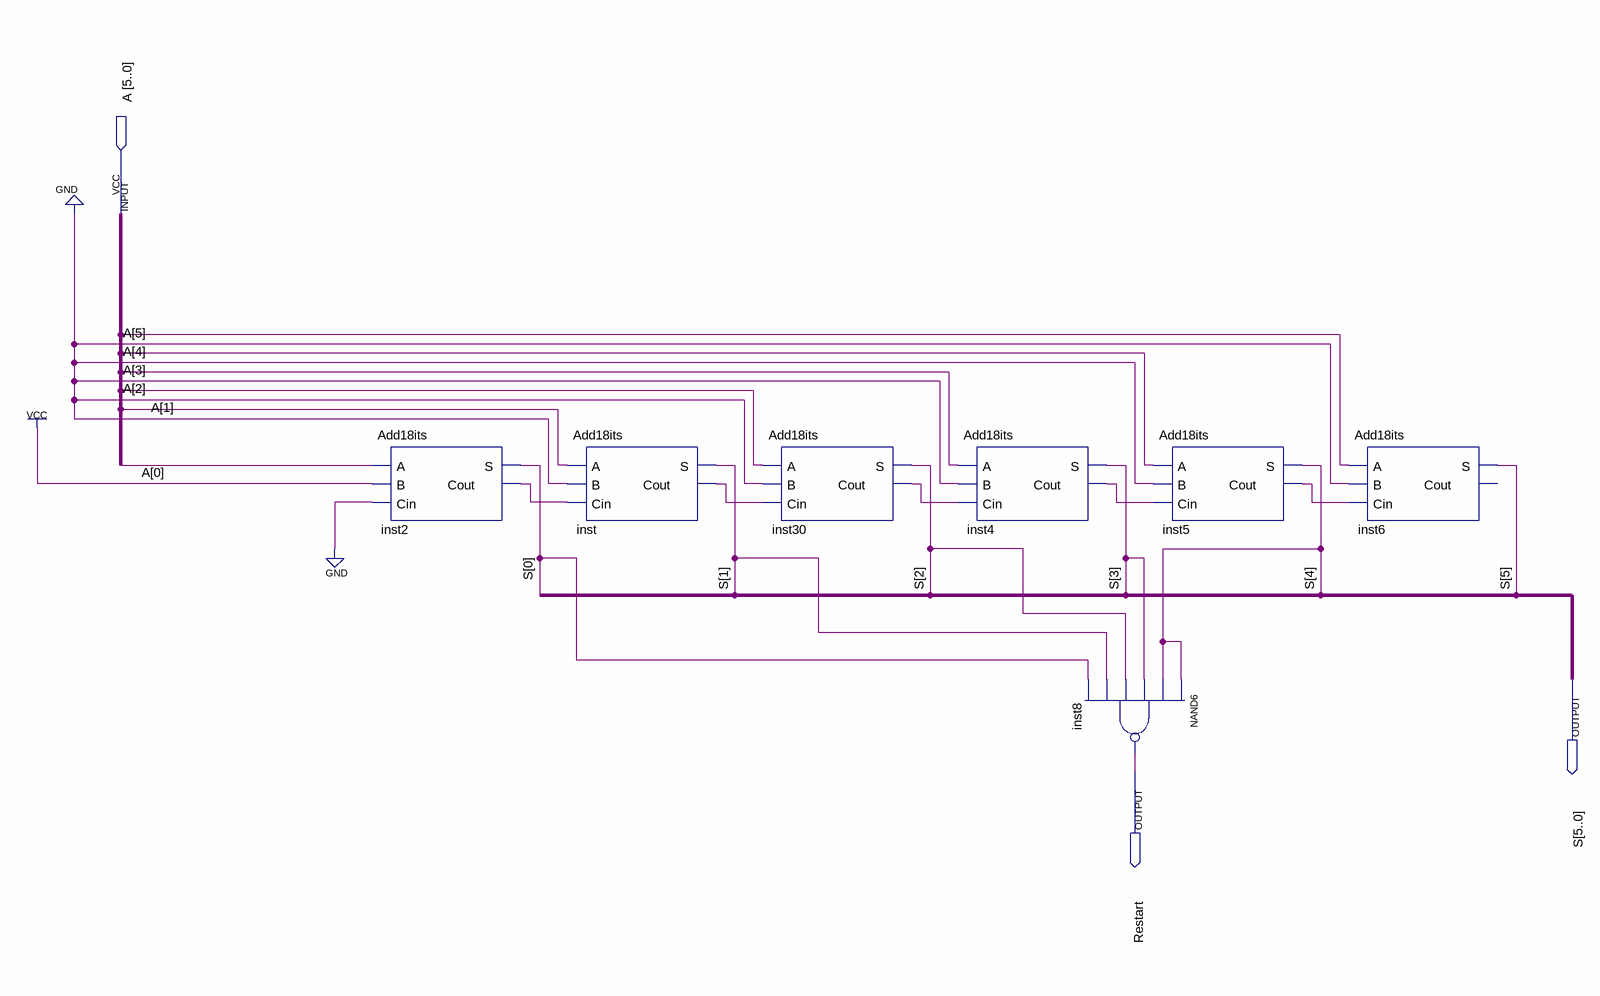
[diagram p0: schematic sheet]
// Quartus schematic Suc5bits.bdf as structural Verilog: 7 symbols, 3 pins
module Suc5bits (
  input  [5:0] A,
  output [5:0] S,
  output Restart
);

  wire inst2_cout, inst4_cout, inst5_cout, inst30_cout, inst_cout;

  Add18its inst2 (.A(A[0]), .B(1'b1), .Cin(1'b0), .S(S[0]), .Cout(inst2_cout));
  Add18its inst (.A(A[1]), .B(1'b0), .Cin(inst2_cout), .S(S[1]), .Cout(inst_cout));
  Add18its inst30 (.A(A[2]), .B(1'b0), .Cin(inst_cout), .S(S[2]), .Cout(inst30_cout));
  Add18its inst4 (.A(A[3]), .B(1'b0), .Cin(inst30_cout), .S(S[3]), .Cout(inst4_cout));
  nand inst8 (Restart, S[4], S[4], S[3], S[2], S[1], S[0]);
  Add18its inst5 (.A(A[4]), .B(1'b0), .Cin(inst4_cout), .S(S[4]), .Cout(inst5_cout));
  Add18its inst6 (.A(A[5]), .B(1'b0), .Cin(inst5_cout), .S(S[5]));  // open: Cout
endmodule
